# Altium schematic sheet Sheet1.SchDoc
size A; SheetNumber: 1; SheetTotal: 2
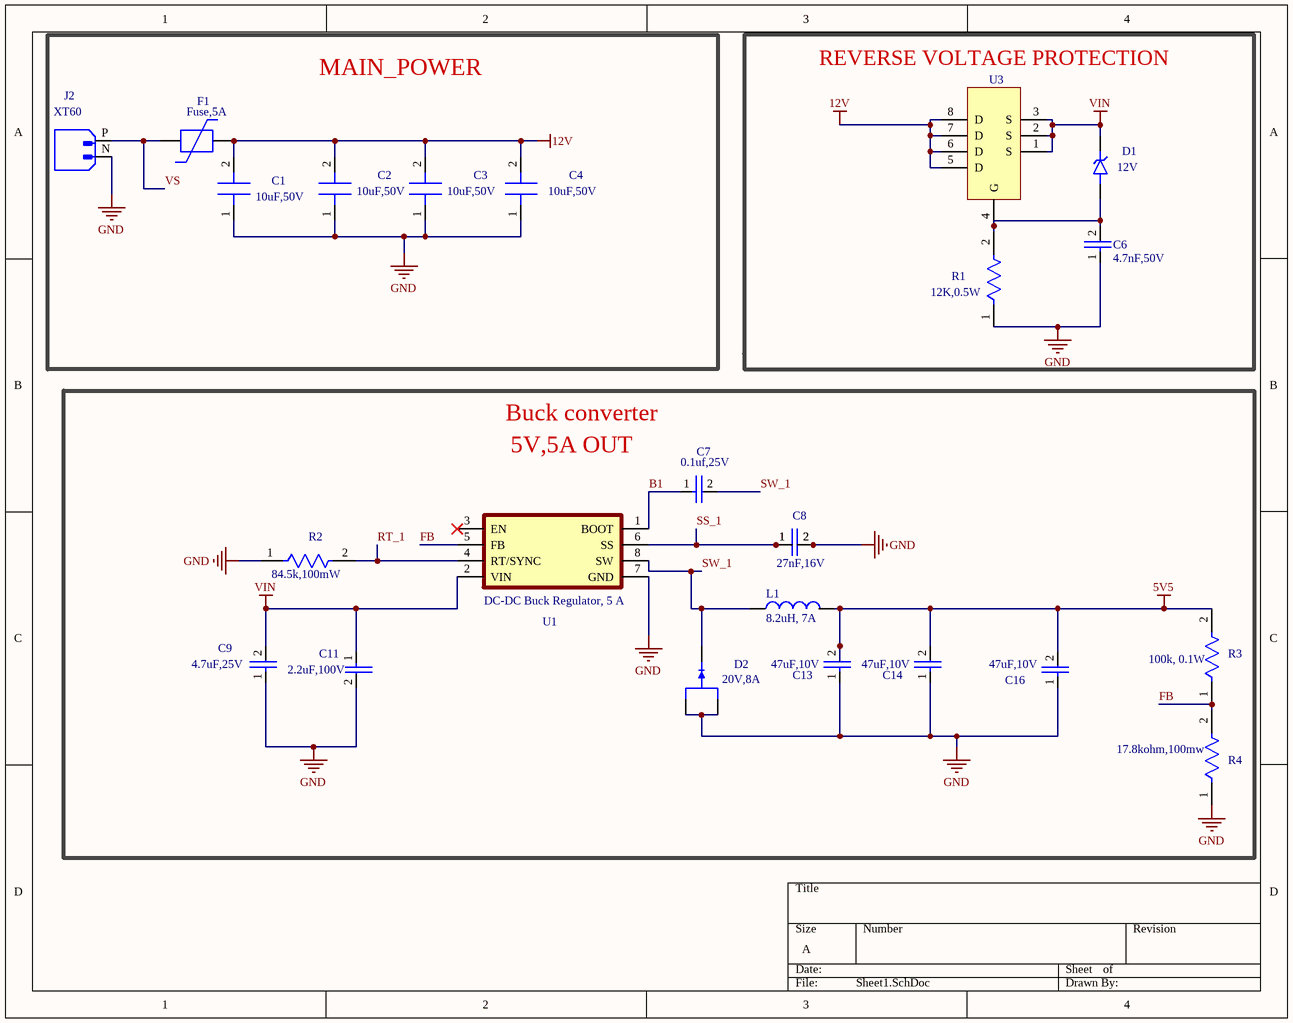
[diagram p0: Sheet1.SchDoc]

## Parts
C1  10uF,50V  [CL31A106KBHNNNE]
C2  10uF,50V  [CL31A106KBHNNNE]
C3  10uF,50V  [CL31A106KBHNNNE]
C4  10uF,50V  [CL31A106KBHNNNE]
C6  4.7nF,50V  [C0603C472F5GACTU]
C7  0.1uf,25V  [CC0603KRX7R8BB104]
C8  27nF,16V  [C0805C273K4HACAUTO]
C9  4.7uF,25V  [GRM188R61E475KE11D]
C11  2.2uF,100V  [CL31A106KBHNNNE]
C13  47uF,10V  [GRM31CR61A476ME15L]
C14  47uF,10V  [GRM31CR61A476ME15L]
C16  47uF,10V  [GRM31CR61A476ME15L]
D1  12V  [SMAZ12-13-F]
D2  20V,8A  [SS12P2L-M3/86A]
F1  Fuse,5A  [2920L500/16MR]
J2  XT60  [XT60-M]
L1  8.2uH, 7A  [SCIHP1040-8R2M]
R1  12K,0.5W  [CRGP1206F12K]
R2  84.5k,100mW  [RC0603FR-0784K5L]
R3  100k, 0.1W  [RT0603CRC07100KL]
R4  17.8kohm,100mw  [RC0603FR-0717K8L]
U1  DC-DC Buck Regulator, 5 A  [LMR14050SDDAR]
U3  P channel mosfet  [SI4435FDY-T1-GE3]  (value not drawn)

## Blocks framed on the sheet
MAIN_POWER: C1-C4 F1 J2
REVERSE VOLTAGE PROTECTION: C6 D1 R1 U3

## Nets
5V5: C13.2 C14.2 C16.2 L1.2 R3.2
12V: C1.2 C2.2 C3.2 C4.2 F1.2 U3.5(D) U3.6(D) U3.7(D) U3.8(D)
GND: C1.1 C2.1 C3.1 C4.1 C6.1 C8.2 C9.1 C11.2 C13.1 C14.1 C16.1 D2.1(A1) D2.2(A2) J2.N(XT60) R1.1 R2.1 R4.1 U1.7(GND)
VIN: C9.2 C11.1 D1.1(K) U1.2(VIN) U3.1(S) U3.2(S) U3.3(S)
B1: C7.1 U1.1(BOOT)
FB: R3.1 R4.2 U1.5(FB)
RT_1: R2.2 U1.4(RT/SYNC)
SS_1: C8.1 U1.6(SS)
SW_1: C7.2 D2.3(K) L1.1 U1.8(SW)
VS: F1.1 J2.P(XT60)
NetC6_2: C6.2 D1.2(A) R1.2 U3.4(G)

Not connected (* = marked no-connect by the designer): U1 3(EN)*

## Notes on the sheet
- Buck converter
- 5V,5A OUT

## Library data of the parts
C1-C4 = CL31A106KBHNNNE: CAP CER 10uF 50V X5R 1206
C6 = C0603C472F5GACTU: 50V 4.7nF C0G 0603 Ceramic Capacitors ROHS; manafucturer part number: C0603C472F5GACTU; supplier part number: C22418770
C7 = CC0603KRX7R8BB104: 25V 100nF X7R ±10% 0603 Ceramic Capacitors ROHS; manafucturer part number: CC0603KRX7R8BB104; supplier part number: C92490
C8 = C0805C273K4HACAUTO: 16V 27nF X8R ±10% 0805 Ceramic Capacitors ROHS; manafucturer part search: C0805C273K4HACAUTO; supplier part number: C2218666
C9 = GRM188R61E475KE11D: 25V 4.7uF X5R ±10% 0603 Ceramic Capacitors ROHS; manafucturer part number: GRM188R61E475KE11D; supplier part number: C90057
C11 = CL31B225KCHSNNE: 100V 2.2uF X7R ±10% 1206 Ceramic Capacitors ROHS; manafucturer part number: CL31B225KCHSNNE; supplier part number: C170101
C13 C14 C16 = GRM31CR61A476ME15L: 10V 47uF X5R ±20% 1206 Ceramic Capacitors ROHS; manafucturer part number: GRM31CR61A476ME15L; supplier part number: C94034
D1 = SMAZ12-13-F: DIODE ZENER 12V 1W SMA; manafucturer part number: SMAZ12-13-F; supplier part number: C110523
D2 = SS12P2L-M3/86A: 20V 560mV@12A 12A TO-277A Single Diodes ROHS; manafucturer part number: SS12P2L-M3/86A; supplier part number: C3758037
F1 = 2920L500/16MR: 16V 5A 40A 10A 5mΩ 2920 PTC Resettable Fuses ROHS; manafucturer part search: 2920L500/16MR; supplier part number: C207091
J2 = XT60-M: Plug; DC supply; XT60; male; PIN: 2; for cable; soldered; 30A; 500V; SNAPEDA_LINK: https://www.snapeda.com/parts/XT60-M/AMASS/view-part/?ref=snap
L1 = SCIHP1040-8R2M: 7A 8.2uH ±20% 10A 31mΩ SMD,11.5x10.2mm Fixed Inductors ROHS; manafucturer part number: SCIHP1040-8R2M; supplier part number: C6293289
R1 = CRGP1206F12K: 12 kOhms ±1% 0.5W, 1/2W Chip Resistor 1206 (3216 Metric) Automotive AEC-Q200, Pulse Withstanding Thick Film; manufucturer part number: CRGP1206F12K; supplier part number: C2082462
R2 = RC0603FR-0784K5L: 100mW 84.5kΩ 75V ±100ppm/℃ Thick Film Resistor ±1% 0603 Chip Resistor - Surface Mount ROHS; manafucturer part number: RC0603FR-0784K5L; supplier part number: C326920
R3 = 100 kOhms ±0.25% 0.1W, 1/10W Chip Resistor 0603 (1608 Metric) - Thin Film: manafucturer part number: RT0603CRE07100KL; supplier part number: C862453
R4 = RC0603FR-0717K8L: 100mW 17.8kΩ 75V ±100ppm/℃ Thick Film Resistor ±1% 0603 Chip Resistor - Surface Mount ROHS; manafucturer part number: RC0603FR-0717K8L; supplier part number: C185364
U1 = LMR14050SDDAR: 2.5MHz 5A Buck Adjustable 800mV~28V 1 SOIC-8-EP Voltage Regulators - DC DC Switching Regulators ROHS; manafucturer part number: LMR14050SDDAR; supplier part number: C155484
U3 = SI4435FDY-T1-GE3: 30V 12.6A 19mΩ@10V,9A 2.2W 2.2V 1 P-Channel SO-8 Single FETs, MOSFETs ROHS; manafucturer part search: SI4435FDY-T1-GE3; supplier part number: C727418